# Altium project Fire Detection Device.PrjPcb
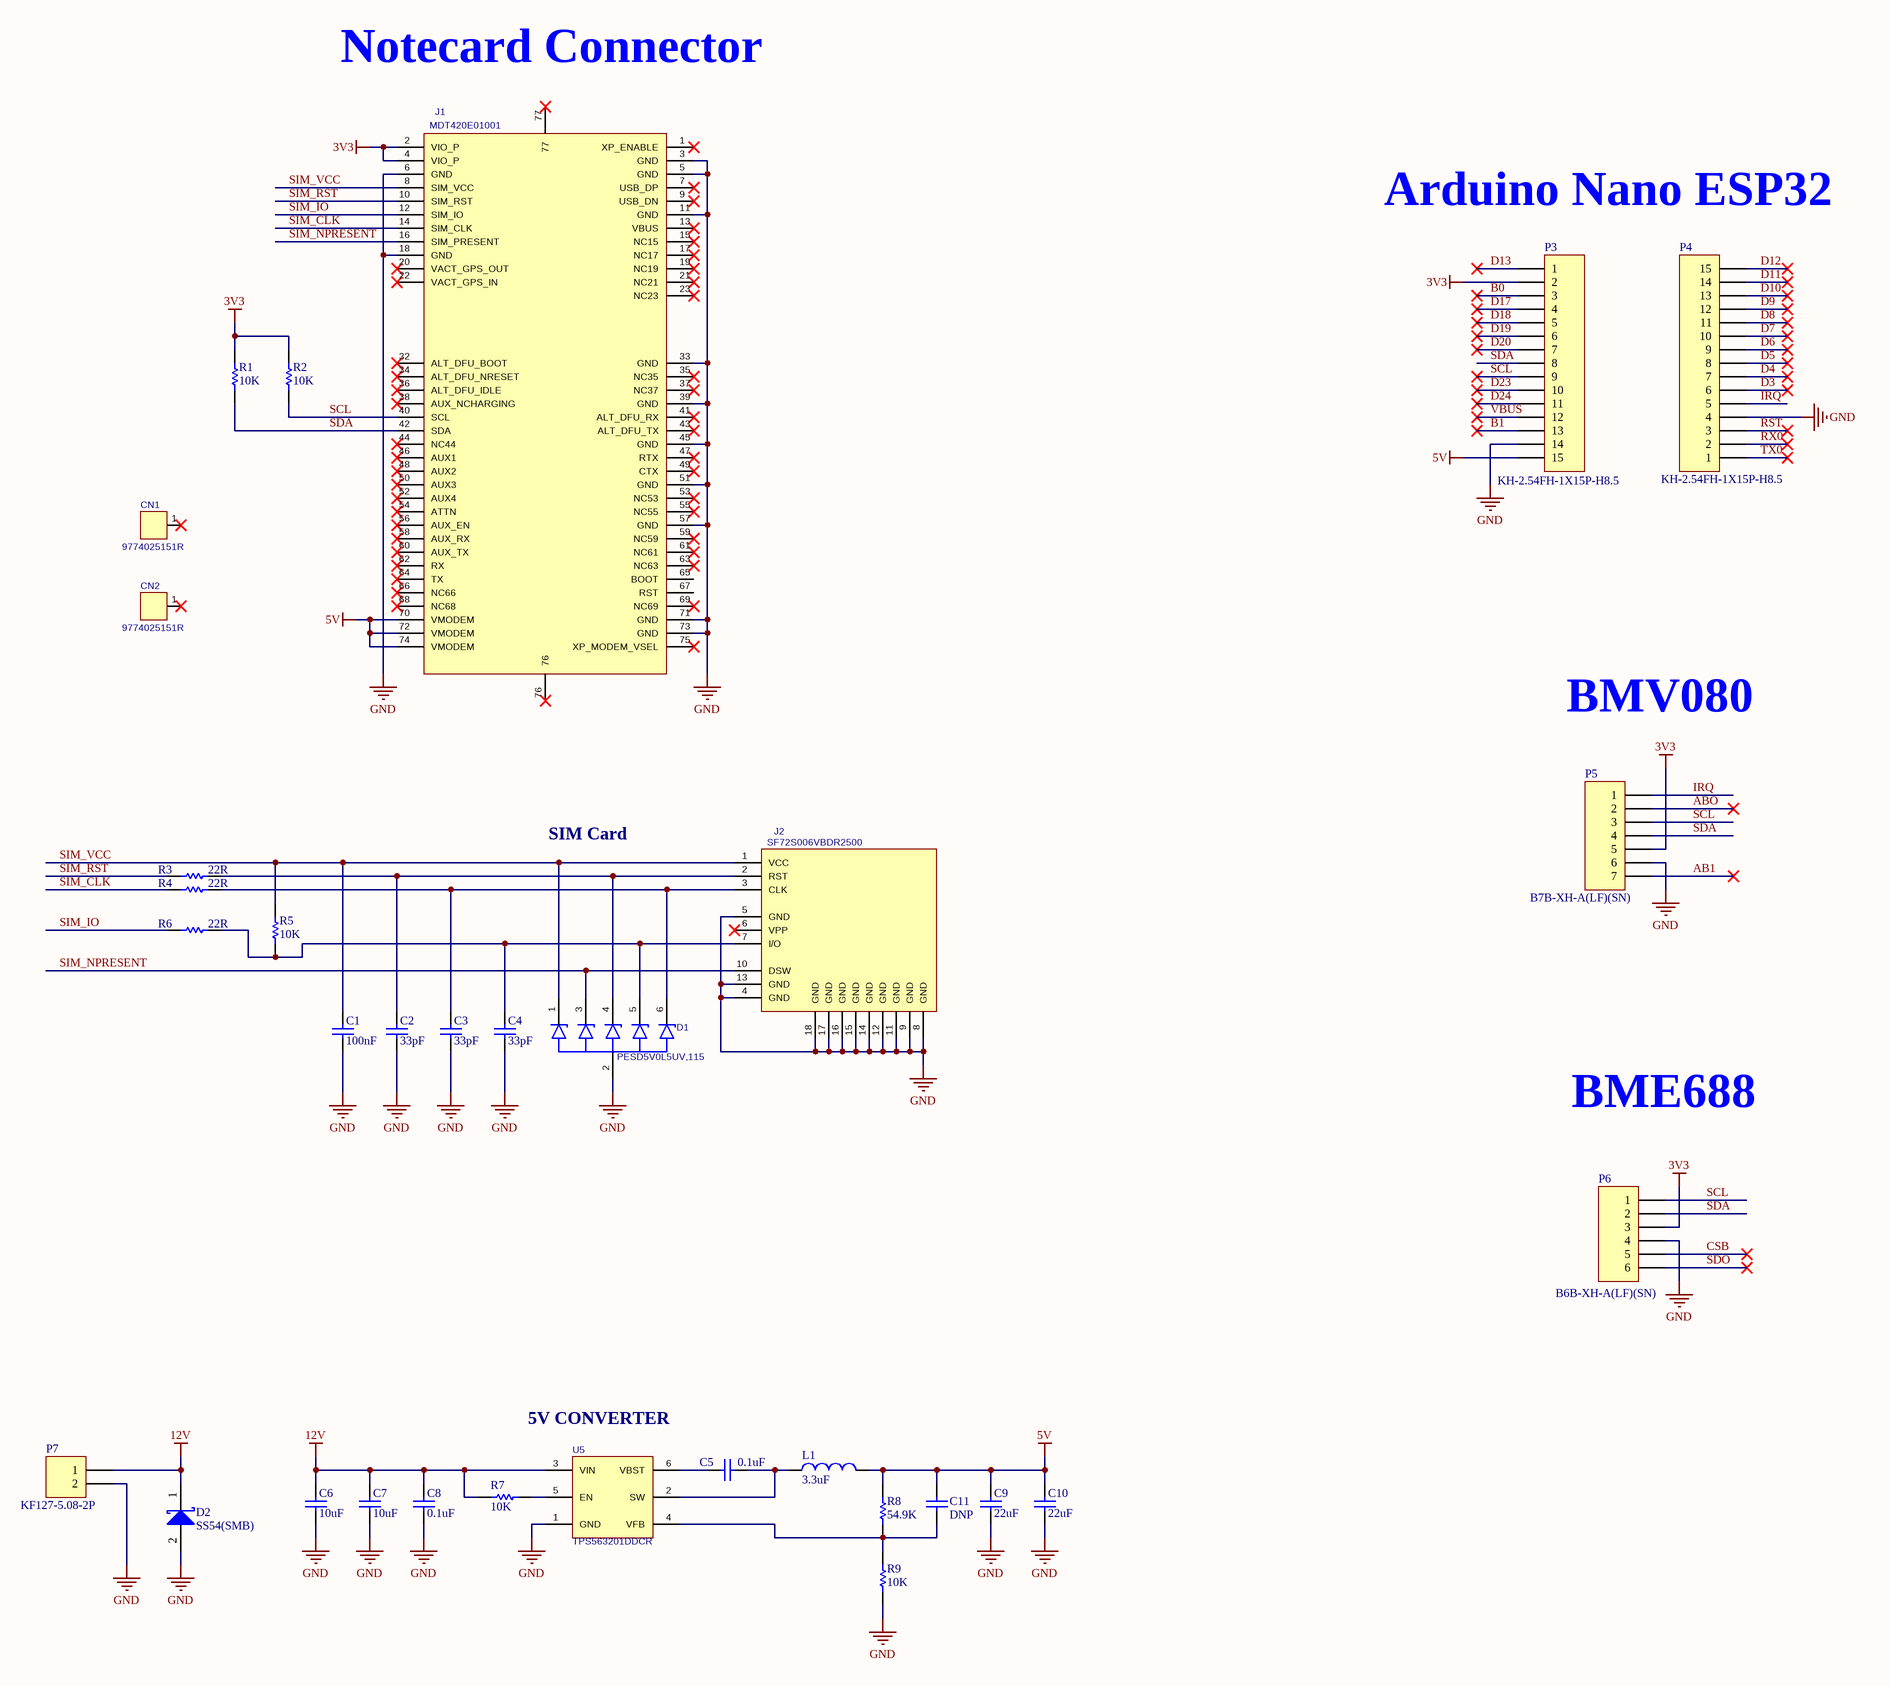
[diagram p0: Sheet1.SchDoc]
1 sheet, 33 parts. Net scope: global (net labels, ports and power ports of the same name join across sheets).
Board file: PCB1.PcbDoc

## Sheet Sheet1.SchDoc
size C; SheetNumber: 1; SheetTotal: 1; SPICEModelCacheIFOIJYOB: <root> / <DocumentId>IFOIJYOB</DocumentId> / <CacheFrame Number="0"> / <Model Name="skydiode" Kind="MDL"> / <Text>*Default Schottky Diode / *Schottky Diode Pinout: A,K / .MODEL SKYDIODE D(EG=0.69 XTI=2)</Text> / </Model> / </CacheFrame> / </root>

### Parts
C1  100nF  [Ceramic capacitor (0402)]
C2  33pF  [Ceramic capacitor (0402)]
C3  33pF  [Ceramic capacitor (0402)]
C4  33pF  [Ceramic capacitor (0402)]
C5  0.1uF  [Ceramic capacitor (0603)]
C6  10uF  [Ceramic capacitor (0805)]
C7  10uF  [Ceramic capacitor (0805)]
C8  0.1uF  [Ceramic capacitor (0805)]
C9  22uF  [Ceramic capacitor (0805)]
C10  22uF  [Ceramic capacitor (0805)]
C11  DNP  [Ceramic capacitor (0603)]
CN1  9774025151R  [SMD-1_BD5.1-D3.5]
CN2  9774025151R  [SMD-1_BD5.1-D3.5]
D1  PESD5V0L5UV,115  [SOT-666-6_L1.6-W1.2-P0.50-LS1.6-TL]
D2  SS54(SMB)  [FP_SS54(SMB)]
J1  MDT420E01001  [CONN-SMD_67P-P0.50_TE_2199119-6]
J2  SF72S006VBDR2500  [NANO-SIM-SMD_SMN-315-ARP7]
L1  3.3uF  [IND-SMD_L7.3-W6.6]
P3  KH-2.54FH-1X15P-H8.5  [HDR-TH_15P-P2.54-V-F]
P4  KH-2.54FH-1X15P-H8.5  [HDR-TH_15P-P2.54-V-F]
P5  B7B-XH-A(LF)(SN)  [CONN-TH_7P-P2.50_B7B-XH-A-LF-SN]
P6  B6B-XH-A(LF)(SN)  [CONN-TH_6P-P2.50_B6B-XH-A-LF-SN]
P7  KF127-5.08-2P  [CONN-TH_P5.08_KF127-5.08-2P]
R1  10K  [Resistor  (0603)]
R2  10K  [Resistor  (0603)]
R3  22R  [Resistor  (0402)]
R4  22R  [Resistor  (0402)]
R5  10K  [Resistor  (0402)]
R6  22R  [Resistor  (0402)]
R7  10K  [Resistor  (0603)]
R8  54.9K  [Resistor  (0603)]
R9  10K  [Resistor  (0603)]
U5  TPS563201DDCR  [SOT-23-6_L2.9-W1.6-P0.95-LS2.8-BR]

### Nets
3V3: J1.2(VIO_P) J1.4(VIO_P) P3.2 P5.5 P6.3 R1.2 R2.2
5V: C9.1 C10.1 C11.2 J1.70(VMODEM) J1.72(VMODEM) J1.74(VMODEM) L1.2 P3.15 R8.2
12V: C6.1 C7.1 C8.1 D2.1(K) P7.1 R7.1 U5.3(VIN)
GND: C1.2 C2.2 C3.2 C4.2 C6.2 C7.2 C8.2 C9.2 C10.2 D1.2 D2.2(A) J1.3(GND) J1.5(GND) J1.6(GND) J1.11(GND) J1.18(GND) J1.33(GND) J1.39(GND) J1.45(GND) J1.51(GND) J1.57(GND) J1.71(GND) J1.73(GND) J2.4(GND) J2.5(GND) J2.8(GND) J2.9(GND) J2.11(GND) J2.12(GND) J2.13(GND) J2.14(GND) J2.15(GND) J2.16(GND) J2.17(GND) J2.18(GND) P3.14 P4.4 P5.6 P6.4 P7.2 R9.1 U5.1(GND)
AB1: P5.7
ABO: P5.2
B0: P3.3
B1: P3.13
CSB: P6.5
D3: P4.6
D4: P4.7
D5: P4.8
D6: P4.9
D7: P4.10
D8: P4.11
D9: P4.12
D10: P4.13
D11: P4.14
D12: P4.15
D13: P3.1
D17: P3.4
D18: P3.5
D19: P3.6
D20: P3.7
D23: P3.10
D24: P3.11
IRQ: P4.5 P5.1
RST: P4.3
RX0: P4.2
SCL: J1.40(SCL) P3.9 P5.3 P6.1 R2.1
SDA: J1.42(SDA) P3.8 P5.4 P6.2 R1.1
SDO: P6.6
SIM_CLK: J1.14(SIM_CLK) R4.1
SIM_IO: J1.12(SIM_IO) R6.1
SIM_NPRESENT: D1.3 J1.16(SIM_PRESENT) J2.10(DSW)
SIM_RST: J1.10(SIM_RST) R3.1
SIM_VCC: C1.1 D1.1 J1.8(SIM_VCC) J2.1(VCC) R5.2
TX0: P4.1
VBUS: P3.12
NetC2_1: C2.1 D1.4 J2.2(RST) R3.2
NetC3_1: C3.1 D1.6 J2.3(CLK) R4.2
NetC4_1: C4.1 D1.5 J2.7(I/O) R5.1 R6.2
NetC5_1: C5.1 L1.1 U5.2(SW)
NetC5_2: C5.2 U5.6(VBST)
NetC11_1: C11.1 R8.1 R9.2 U5.4(VFB)
NetR7_2: R7.2 U5.5(EN)

Not connected (* = marked no-connect by the designer): CN1 1*; CN2 1*; J1 1(XP_ENABLE)* 7(USB_DP)* 9(USB_DN)* 13(VBUS)* 15(NC15)* 17(NC17)* 19(NC19)* 20(VACT_GPS_OUT)* 21(NC21)* 22(VACT_GPS_IN)* 23(NC23)* 32(ALT_DFU_BOOT)* 34(ALT_DFU_NRESET)* 35(NC35)* 36(ALT_DFU_IDLE)* 37(NC37)* 38(AUX_NCHARGING)* 41(ALT_DFU_RX)* 43(ALT_DFU_TX)* 44(NC44)* 46(AUX1)* 47(RTX)* 48(AUX2)* 49(CTX)* 50(AUX3)* 52(AUX4)* 53(NC53)* 54(ATTN)* 55(NC55)* 56(AUX_EN)* 58(AUX_RX)* 59(NC59)* 60(AUX_TX)* 61(NC61)* 62(RX)* 63(NC63)* 64(TX)* 65(BOOT) 66(NC66)* 67(RST) 68(NC68)* 69(NC69)* 75(XP_MODEM_VSEL)* 76* 77*; J2 6(VPP)*

### Notes on the sheet
- Notecard Connector
- Arduino Nano ESP32
- BMV080
- SIM Card
- BME688
- (near U5) 5V CONVERTER

### Library data of the parts
C1 = Cap: Capacitor; Part Number: C1525; Value: 100nF; Package: 0402
C2-C4 = Cap: Capacitor; Part Number: C107005; Value: 33pF; Package: 0402
C5 = Cap: Capacitor; Part Number: C14663; Value: 100nF; Package: 0603
C6 C7 = Cap: Capacitor; Part Number: C15850; Value: 10uF; Package: 0805
C8 = Cap: Capacitor; Part Number: C519981; Value: 100nF; Package: 0805
C9 C10 = Cap: Capacitor; Part Number: C296720; Value: 22uF; Package: 0805
C11 = Cap: Capacitor; Part Number: DNP
CN1 CN2 = 9774025151R_C7496631: Manufacturer: Wurth(伍尔特); AddInBom: yes; Symbol: 9774025151R_C7496631; Device: 9774025151R_C7496631; LCSC Part Name: SMT钢质间隔柱，带内螺纹; Part Number: C7496631; ManufacturerPart: 9774025151R; Supplier Footprint: SMD; JLCPCB Part Class: Extended Part; Datasheet: https://www.we-online.com/components/products/datasheet/9774025151R.pdf; Supplier: LCSC; ConvertToPcb: yes; FootprintName: SMD-1_BD5.1-D3.5
D1 = PESD5V0L5UV,115: Polarity:Unidirectional Reverse Stand-Off Voltage (Vrwm):5V Clamping Voltage:12V Peak Pulse Current (Ipp):2.5A Peak Pulse Power Dissipation (Ppp):25W Voltage - Breakdown:6.4V Reverse Leakage Current (Ir):5nA Number of Channels:5 Operating Temperature:-65℃; Part Number: C84255; Manufacturer: Nexperia(安世); AddInBom: yes; ModelId: d819e0c908004c6d9ba8e512fd29870dÂŽ0819f05c4eef4c71ace90d822a990e87; ModelName: SOT-666-6P_L1.6-W1.2-H0.6-LS1.6-P0.50; ModelTransform: 62.992,62.992,0,0,0,0,0,-0.787,0; Reverse Stand-Off Voltage (Vrwm): 5V; Clamping Voltage: 12V; Peak Pulse Current (Ipp): 2.5A; Peak Pulse Power Dissipation (Ppp): 25W; Voltage - Breakdown: 6.4V; Reverse Leakage Current (Ir): 5nA; Number of Channels: 5; level of protection: IEC 61000-4-5；IEC 61000-4-2; Type: ESD; Junction Capacitance: 16pF; Symbol: PESD5V0L5UV,115; Device: PESD5V0L5UV,115; LCSC Part Name: 单向ESD 5V截止 峰值脉冲电流：2.5A; ManufacturerPart: PESD5V0L5UV,115; Supplier Footprint: SOT-666-6; JLCPCB Part Class: Extended Part; Datasheet: https://item.szlcsc.com/datasheet/PESD5V0L5UV%252C115/85424.html; Supplier: LCSC; ConvertToPcb: yes; FootprintName: SOT-666-6_L1.6-W1.2-P0.50-LS1.6-TL; Polarity: Unidirectional; Operating Temperature: -65℃~+150℃@(Ta)
D2 = D Schottky: Schottky Diode; Part Number: C4154972; Published: 8-Jun-2000; LatestRevisionDate: 17-Jul-2002; LatestRevisionNote: Re-released for DXP Platform.; PackageReference: SMB; Publisher: Altium Limited; PackageDescription: DO-214-AA/SMB; 2 C-Bend Leads; Body 5.3 x 3.6 mm, inc. leads (LxW); Code_JEDEC: DO-214-AA
J1 = MDT420E01001: Pitch:0.5mm Number of Pins:67P Mounting Type:Surface Mount, Right Angle Contact Material:Copper Alloy Contact Plating:Gold Operating Temperature:-40℃~+80℃ Operating Temperature:-40℃~+80℃; Part Number: C4529147; Manufacturer: Amphenol; AddInBom: yes; ModelId: e7e3dc45d4774ef5a0346ca1df8579fbÂŽ0819f05c4eef4c71ace90d822a990e87; ModelTransform: 862.203,342.51896,0,0,0,0,0,0,-21.6535; Pitch: 0.5mm; Symbol: MDT420E01001; Device: MDT420E01001; LCSC Part Name: 0.5mm P数:67P; ManufacturerPart: MDT420E01001; Supplier Footprint: SMD,P=0.5mm,卧贴; JLCPCB Part Class: Extended Part; Datasheet: https://item.szlcsc.com/datasheet/MDT420E01001/5100227.html; Supplier: LCSC; ConvertToPcb: yes; FootprintName: CONN-SMD_67P-P0.50_TE_2199119-6; ModelName: CONN-SMD_67P-P0.50_TE_2199119-6; Number of Pins: 67P; Mounting Type: Surface Mount, Right Angle; Contact Material: Copper Alloy; Contact Plating: Gold; Operating Temperature: -40℃~+80℃
J2 = SF72S006VBDR2500: Card Connection Mode:Push-Push Card Type:Nano-SIM Card Connector Type:Connector and Ejector Height Above Board:1.25mm Rated Voltage (Max):10V Operating Temperature:-25℃~+85℃ Operating Temperature:-25℃~+85℃; Part Number: C2977286; Manufacturer: JAE(日本航空电子); AddInBom: yes; ModelId: 655216ee1d564b619435ec7217f45a29ÂŽ0819f05c4eef4c71ace90d822a990e87; ModelTransform: 440.944,569.036,0,0,0,0,-0.003,0.004,0; Rated Voltage (Max): 10V; Symbol: SF72S006VBDR2500; Device: SF72S006VBDR2500; LCSC Part Name: 自弹式 NanoSIM卡 卡座; ManufacturerPart: SF72S006VBDR2500; Supplier Footprint: SMD; JLCPCB Part Class: Extended Part; Datasheet: https://item.szlcsc.com/datasheet/SF72S006VBDR2500/3386692.html; Supplier: LCSC; ConvertToPcb: yes; FootprintName: NANO-SIM-SMD_SMN-315-ARP7; ModelName: NANO-SIM-SMD_SMN-315-ARP7; Card Connection Mode: Push-Push; Card Type: Nano-SIM Card; Connector Type: Connector and Ejector; Height Above Board: 1.25mm; Operating Temperature: -25℃~+85℃
L1 = Inductor: Part Number: C128687; Published: 8-Jun-2000; LatestRevisionDate: 29-May-2009; LatestRevisionNote: IPC-7351 Footprint Added.; PackageReference: 0402-A; Publisher: Altium Limited; PackageDescription: Chip Inductor
P3 P4 = Header 15: Header, 15-Pin; Part Number: C2932676; LatestRevisionDate: 17-Jul-2002; LatestRevisionNote: Re-released for DXP Platform.; Publisher: Altium Limited
P5 = Header 7: Part Number: C144398; LatestRevisionDate: 17-Jul-2002; LatestRevisionNote: Re-released for DXP Platform.; Publisher: Altium Limited
P6 = Header 6: Part Number: C144397; LatestRevisionDate: 17-Jul-2002; LatestRevisionNote: Re-released for DXP Platform.; Publisher: Altium Limited
P7 = Header 2: Header, 2-Pin; Part Number: C474906; LatestRevisionDate: 17-Jul-2002; LatestRevisionNote: Re-released for DXP Platform.; Publisher: Altium Limited
R1 R2 = Res Semi: Semiconductor Resistor; Part Number: C191124; Value: 10K; Package: 0603
R3 R4 R6 = Res Semi: Semiconductor Resistor; Part Number: C25092; Value: 22R; Package: 0402
R5 = Res Semi: Semiconductor Resistor; Part Number: C427247; Value: 10K; Package: 0402
R7 = Res Semi: Semiconductor Resistor; Part Number: C136139; Value: 10K; Package: 0603
R8 = Res Semi: Semiconductor Resistor; Part Number: C185321; Value: 54.9K; Package: 0603
R9 = Res Semi: Semiconductor Resistor; Part Number: C130232; Value: 10K; Package: 0603
U5 = TPS563201DDCR: Function:Step-down type Voltage - Supply:4.5V~17V Voltage - Supply:4.5V~17V Output Voltage:768mV~7V Output Voltage:768mV~7V Output Current:3A Frequency - Switching:580kHz Frequency - Switching:580kHz Operating Temperature:-40℃~+125℃@(TJ) Operating Tempera; Part Number: C116592; Manufacturer: TI(德州仪器); AddInBom: yes; ModelId: 1370be37a17e44418ae52e2b4cc1f5e5ÂŽ0819f05c4eef4c71ace90d822a990e87; ModelName: SOT-23-6_L2.9-W1.6-H1.5-LS2.8-P0.95; ModelTransform: 110.73671,114.173,0,180,0,0,0.001,-0.003,0; Output Current: 3A; Frequency - Switching: 580kHz; Number of Outputs: 1; Topology: Buck; Quiescent Current: 380uA; Switch tube (built-in/external): Built-in; Output Type: Adjustable; Symbol: TPS563201DDCR; Device: TPS563201DDCR; LCSC Part Name: 降压型 3A 4.5V~17V; ManufacturerPart: TPS563201DDCR; Supplier Footprint: SOT-23-THIN-6; JLCPCB Part Class: Extended Part; Datasheet: https://item.szlcsc.com/datasheet/TPS563201DDCR/117846.html; Supplier: LCSC; ConvertToPcb: yes; FootprintName: SOT-23-6_L2.9-W1.6-P0.95-LS2.8-BR; Function: Step-down type; Voltage - Supply: 4.5V~17V; Output Voltage: 768mV~7V; Operating Temperature: -40℃~+125℃@(TJ); Synchronous Rectifier: Yes; Features: Light load efficient mode；Cycle-by-cycle current limiting；Overcurrent Protection；Hiccup current limiting